# EAGLE design Adafruit DVI Sock for Pico (EAGLE 9.6.2)
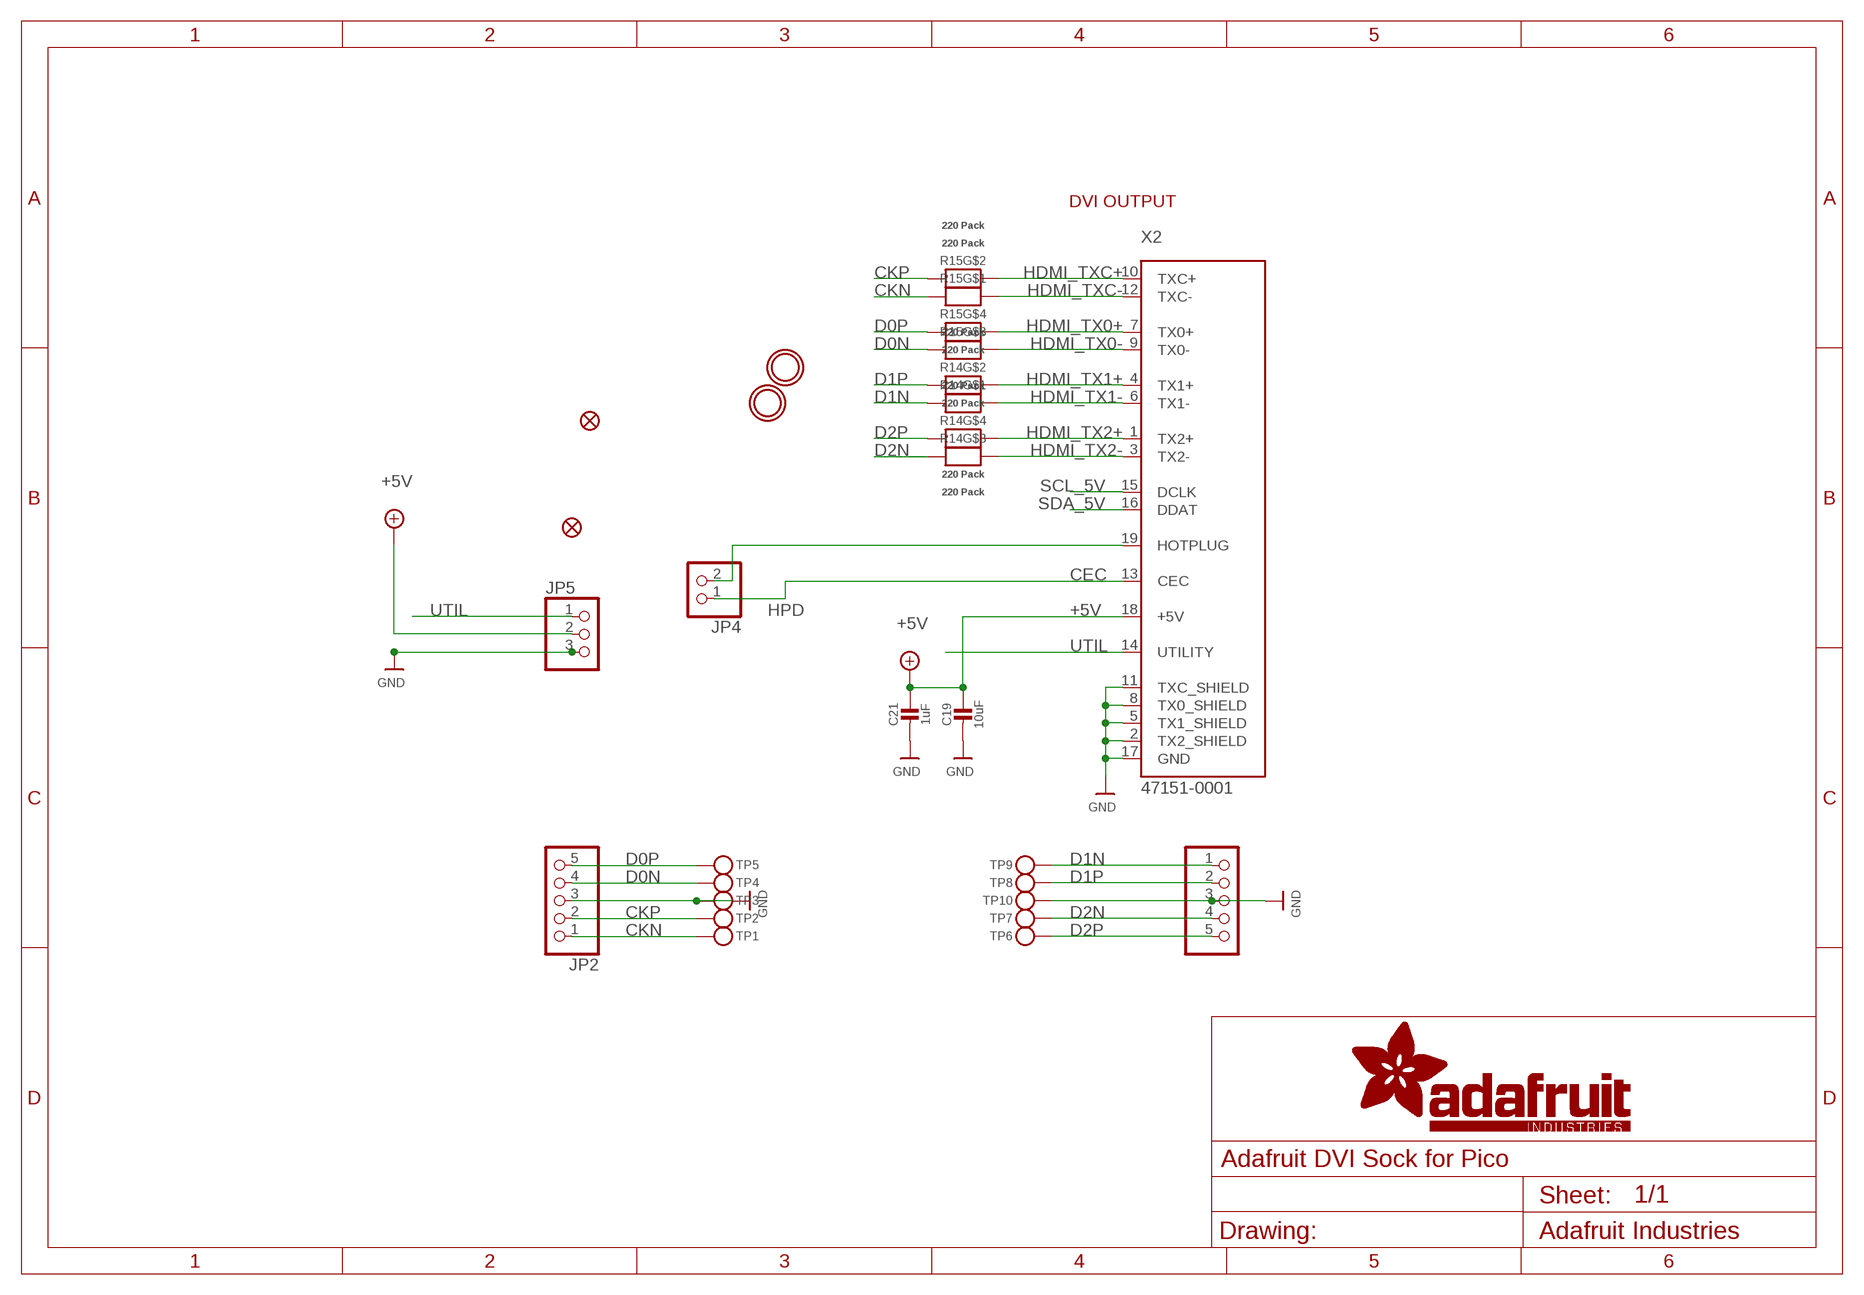
[diagram p0: schematic, sheet 1]

## Parts
C19  10uF  CAP_CERAMIC0805-NOOUTLINE  [0805-NO]
C21  1uF  CAP_CERAMIC0603_NO  [0603-NO]
FID1  FIDUCIAL_1MM  [FIDUCIAL_1MM]
FID2  FIDUCIAL_1MM  [FIDUCIAL_1MM]
JP2  HEADER-1X5  [1X05_OVAL]
JP3  HEADER-1X5  [1X05_OVAL]
JP4  HEADER-1X2ROUND  [1X02_ROUND]
JP5  HEADER-1X3ROUND  [1X03_ROUND]
R14  220 Pack  RESISTOR_4PACK  [RESPACK_4X0603]
R15  220 Pack  RESISTOR_4PACK  [RESPACK_4X0603]
TP1  TESTPOINT_1X3  [TESTPOINT_RECT_1X3MM]
TP2  TESTPOINT_1X3  [TESTPOINT_RECT_1X3MM]
TP3  TESTPOINT_1X3  [TESTPOINT_RECT_1X3MM]
TP4  TESTPOINT_1X3  [TESTPOINT_RECT_1X3MM]
TP5  TESTPOINT_1X3  [TESTPOINT_RECT_1X3MM]
TP6  TESTPOINT_1X3  [TESTPOINT_RECT_1X3MM]
TP7  TESTPOINT_1X3  [TESTPOINT_RECT_1X3MM]
TP8  TESTPOINT_1X3  [TESTPOINT_RECT_1X3MM]
TP9  TESTPOINT_1X3  [TESTPOINT_RECT_1X3MM]
TP10  TESTPOINT_1X3  [TESTPOINT_RECT_1X3MM]
U$5  MOUNTINGHOLE2.5  [MOUNTINGHOLE_2.5_PLATED]
U$6  MOUNTINGHOLE2.5  [MOUNTINGHOLE_2.5_PLATED]
X2  47151-0001  HDMI_MOLEX_47151  [HDMI_MOLEX_47151-0001]

## Nets
+5V: C19.1 C21.1 JP5.2 X2.18(+5V)
CEC: JP4.1 X2.13(CEC)
CKN: JP2.1 R15.8 TP1.P$1
CKP: JP2.2 R15.7 TP2.P$1
D0N: JP2.4 R15.6 TP4.P$1
D0P: JP2.5 R15.5 TP5.P$1
D1N: JP3.1 R14.8 TP9.P$1
D1P: JP3.2 R14.7 TP8.P$1
D2N: JP3.4 R14.6 TP7.P$1
D2P: JP3.5 R14.5 TP6.P$1
GND: C19.2 C21.2 JP2.3 JP3.3 JP5.3 TP3.P$1 TP10.P$1 X2.2(TX2_SHIELD) X2.5(TX1_SHIELD) X2.8(TX0_SHIELD) X2.11(TXC_SHIELD) X2.17(GND)
HDMI_TX0+: R15.4 X2.7(TX0+)
HDMI_TX0-: R15.3 X2.9(TX0-)
HDMI_TX1+: R14.2 X2.4(TX1+)
HDMI_TX1-: R14.1 X2.6(TX1-)
HDMI_TX2+: R14.4 X2.1(TX2+)
HDMI_TX2-: R14.3 X2.3(TX2-)
HDMI_TXC+: R15.2 X2.10(TXC+)
HDMI_TXC-: R15.1 X2.12(TXC-)
HPD: JP4.2 X2.19(HOTPLUG)
SCL_5V: X2.15(DCLK)
SDA_5V: X2.16(DDAT)
UTIL: JP5.1 X2.14(UTILITY)

## Notes on the sheet
- DVI OUTPUT

## Power pins joined to a net without a drawn wire
GND: X2.P$1(GND) X2.P$2(GND) X2.P$3(GND) X2.P$4(GND)

## Library data of the parts
C19 = microbuilder:CAP_CERAMIC: Ceramic Capacitors For new designs, use the packages preceded by an '_' character since they are more reliable: The following footprints should be used on most boards: _0402 - Standard footprint for regular board layouts _0603 - Standard footprint for regular board layouts _0805 - Standard footprint for regular board layouts _1206 - Standard footprint for regular board layouts For extremely tight-pitch boards where space is at a premium, the following 'micro-pitch' footprints can be used (smaller pads, no silkscreen outline, etc.): _0402MP - Micro-pitch footprint for very dense/compact boards _0603MP - Micro-pitch footprint for very dense/compact boards _0805MP - Micro-pitch footprint for very dense/compact boards _1206MP - Micro-pitch footprint for very dense/compact boards; REV: A
C21 = microbuilder:CAP_CERAMIC: Ceramic Capacitors For new designs, use the packages preceded by an '_' character since they are more reliable: The following footprints should be used on most boards: _0402 - Standard footprint for regular board layouts _0603 - Standard footprint for regular board layouts _0805 - Standard footprint for regular board layouts _1206 - Standard footprint for regular board layouts For extremely tight-pitch boards where space is at a premium, the following 'micro-pitch' footprints can be used (smaller pads, no silkscreen outline, etc.): _0402MP - Micro-pitch footprint for very dense/compact boards _0603MP - Micro-pitch footprint for very dense/compact boards _0805MP - Micro-pitch footprint for very dense/compact boards _1206MP - Micro-pitch footprint for very dense/compact boards
FID1 FID2 = microbuilder:FIDUCIAL: Fiducial Alignment Points Various fiducial points for machine vision alignment.; BOM: EXCLUDE
JP2 JP3 = microbuilder:HEADER-1X5: PIN HEADER
JP4 = microbuilder:HEADER-1X2: PIN HEADER
JP5 = microbuilder:HEADER-1X3: PIN HEADER
R14 R15 = microbuilder:RESISTOR_4PACK: Resistor Packs (4 resistors) 4 x 0603 10K 1/16W - Digikey: YC164J-10KCT-ND
TP1-TP10 = microbuilder:TESTPOINT: Test Point Various test points for characterisation and PCB testing TESTPOINT_SMT - Compact Surface Mount Test Point [Digikey: 5016KTR-ND]
U$5 U$6 = adafruit_electromech:MOUNTINGHOLE: Mounting Hole For #2 screws (0.086"/2.18mm width, 0.094"/2.4mm hole) use 2.5mm; BOM: EXCLUDE
X2 = adafruit_electromech:HDMI_MOLEX_47151: The default footprint uses layer 46 (Milling) for the tabs, the DIMLAYER footprint uses layer 20 (Dimensions). Both will probably require special instructions to the board house; LCSC: C138388

## Net classes
1 highpower: width 0.305 mm, drill 0.381 mm

## Board
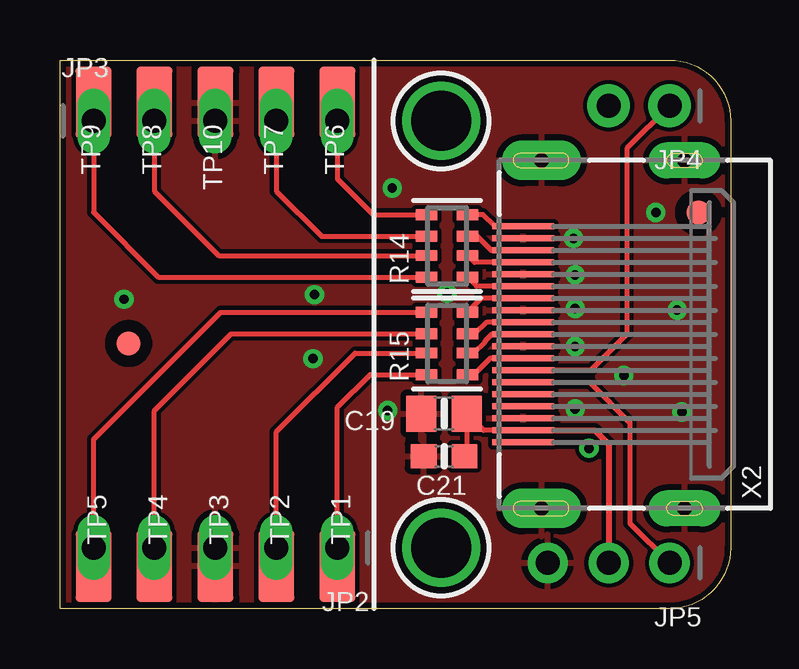
[diagram p1: board, top side]
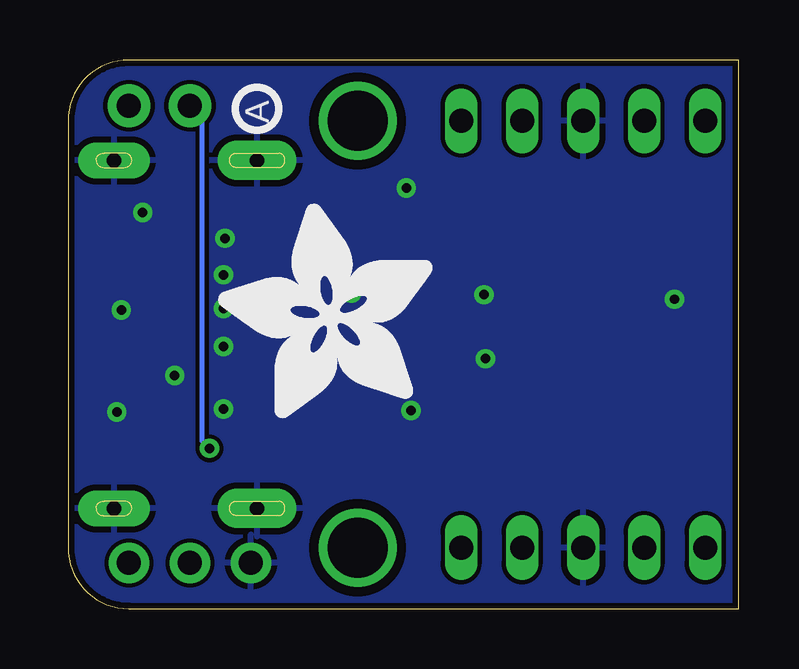
[diagram p2: board, bottom side, seen from below]

Size 27.94 x 22.86 mm. Coordinates in mm from the lower left corner, seen from the top.
Outline: 0,0 0,22.86 25.4,22.86 arc-90 27.94,20.32 27.94,2.54 arc-90 25.4,0 0,0
Copper layers (1*16): Top 0.035mm / dielectric 1.5mm / Bottom 0.035mm
Design rules "adafruit 7-7": minimum track width 7mil, minimum drill 15.5mil, track to track 7mil, track to pad 7mil, pad to pad 7mil, via to via 7mil, smd to smd 7mil, copper to edge 10mil, drill to drill 8mil, minimum pad ring 7mil, minimum via ring 8mil, stop-mask expansion 2mil, vias tented up to drill 20mil, thermal gap 10mil

### Footprints (pad centres in the part's own frame; a part is rotated, then mirrored left to right if it is on the bottom)
0805-NO = smd 1.24 x 1.5: 1 -0.95,0; 2 0.95,0
0603-NO = smd 1.075 x 1: 1 -0.85,0; 2 0.85,0
FIDUCIAL_1MM = smd 1 x 1: 1 0,0
1X05_OVAL = drill 1 long: 1 -5.08,0; 2 -2.54,0; 3 0,0; 4 2.54,0; 5 5.08,0
1X02_ROUND = drill 1 pad 1.778: 1 -1.27,0; 2 1.27,0
1X03_ROUND = drill 1 pad 1.676: 1 -2.54,0; 2 0,0; 3 2.54,0
RESPACK_4X0603 = smd 0.45 x 0.9: 1 -1.3,-0.85; 2 -0.4,-0.85; 3 0.4,-0.85; 4 1.3,-0.85; 5 1.3,0.85; 6 0.4,0.85; 7 -0.4,0.85; 8 -1.3,0.85
TESTPOINT_RECT_1X3MM = smd 3 x 1.5: P$1 0,0
MOUNTINGHOLE_2.5_PLATED = drill 2.5 pad 3.2: P$1 0,0
HDMI_MOLEX_47151-0001 = smd 0.25 x 2.6: 1 4.5,3.302; 2 4,3.302; 3 3.5,3.302; 4 3,3.302; 5 2.5,3.302; 6 2,3.302; 7 1.5,3.302; 8 1,3.302; 9 0.5,3.302; 10 0,3.302; 11 -0.5,3.302; 12 -1,3.302; 13 -1.5,3.302; 14 -2,3.302; 15 -2.5,3.302; 16 -3,3.302; 17 -3.5,3.302; 18 -4,3.302; 19 -4.5,3.302 | drill 0.6 pad 1.65 long: P$1 -7.25,2.542; P$2 7.25,2.542 | drill 0.6 pad 1.5 long: P$3 7.25,-3.418; P$4 -7.25,-3.418

### Placement (x,y rotation side)
C19  16,8.13 180 top
C21  16,6.35 180 top
E$1  [PCBFEAT-REV-040]  20.07,20.83 270 bottom
FID1  26.61,16.51 0 top
FID2  2.86,11.05 0 top
JP2  6.48,2.54 180 top
JP3  6.48,20.32 0 top
JP4  24.13,20.95 180 top
JP5  22.86,1.91 180 top
PLABEL0  [PLABEL0]  23.37,0.25 90 top
PLABEL1  [PLABEL1]  27.43,1.14 90 top
PLABEL2  [PLABEL2]  19.18,0.25 90 top
PLABEL3  [PLABEL3]  27.56,19.56 90 top
PLABEL4  [PLABEL4]  21.59,19.81 90 top
PLABEL5  [PLABEL5]  7.49,5.46 90 top
PLABEL6  [PLABEL6]  11.56,4.19 90 top
PLABEL7  [PLABEL7]  9.02,4.19 90 top
PLABEL9  [PLABEL9]  3.94,4.19 90 top
PLABEL10  [PLABEL10]  1.4,4.19 90 top
PLABEL11  [PLABEL11]  11.56,12.06 90 top
PLABEL12  [PLABEL12]  9.02,12.83 90 top
PLABEL14  [PLABEL14]  3.94,12.06 90 top
PLABEL15  [PLABEL15]  1.4,12.83 90 top
PLABEL16  [PLABEL16]  24.64,11.75 90 bottom
PLABEL17  [PLABEL17]  11.56,4.13 90 bottom
PLABEL18  [PLABEL18]  9.02,4.13 90 bottom
PLABEL19  [PLABEL19]  6.48,4.25 90 bottom
PLABEL20  [PLABEL20]  3.94,4.13 90 bottom
PLABEL21  [PLABEL21]  1.4,4.13 90 bottom
PLABEL22  [PLABEL22]  11.56,12.26 90 bottom
PLABEL23  [PLABEL23]  9.02,13.02 90 bottom
PLABEL24  [PLABEL24]  6.48,14.67 90 bottom
PLABEL25  [PLABEL25]  3.94,12.26 90 bottom
PLABEL26  [PLABEL26]  1.4,12.76 90 bottom
R14  16.13,15.11 90 top
R15  16.13,11.05 90 top
TP1  11.56,1.78 90 top
TP2  9.02,1.78 90 top
TP3  6.48,1.78 90 top
TP4  3.94,1.78 90 top
TP5  1.4,1.78 90 top
TP6  11.56,21.08 270 top
TP7  9.02,21.08 270 top
TP8  3.94,21.08 270 top
TP9  1.4,21.08 270 top
TP10  6.48,21.08 270 top
U$5  15.88,2.54 0 top
U$6  15.88,20.32 0 top
U$7  [ADAFRUIT_9MM]  12.76,7.94 90 bottom
X2  22.61,11.43 90 top

### Tracks (layer width: path | path; a pad name or v marks a point on that pad's centre or on a via)
+5V
  Top 0.203: X2.18 17.65,7.43 C19.1 16.95,6.45 C21.1
  Top 0.254: X2.18 22.29,7.43 22.86,6.86 JP5.2
CEC
  Top 0.203: JP4.1 23.62,19.18 23.62,11.43 22.12,9.93 X2.13
CKN
  Top 0.203: JP2.1 11.56,8.38 12.92,9.75 R15.8
  Top 0.406: TP1.P$1 JP2.1
CKP
  Top 0.203: JP2.2 9.02,2.67 9.02,7.37 12.3,10.65 R15.7
  Top 0.406: TP2.P$1 9.02,2.67
D0N
  Top 0.203: JP2.4 3.94,8.26 7.13,11.45 R15.6
  Top 0.406: TP4.P$1 JP2.4
D0P
  Top 0.203: JP2.5 1.4,7.05 6.7,12.35 R15.5
  Top 0.406: TP5.P$1 JP2.5
D1N
  Top 0.203: JP3.1 1.4,16.51 4.09,13.81 R14.8
  Top 0.406: TP9.P$1 JP3.1
D1P
  Top 0.203: JP3.2 3.94,17.4 6.62,14.71 R14.7
  Top 0.406: TP8.P$1 JP3.2
D2N
  Top 0.203: JP3.4 9.02,17.4 10.9,15.51 R14.6
  Top 0.406: TP7.P$1 JP3.4
D2P
  Top 0.203: JP3.5 11.56,17.91 13.05,16.41 R14.5
  Top 0.406: TP6.P$1 JP3.5
GND  (via drill 0.39)
  Top 0.406: TP10.P$1 JP3.3 | TP3.P$1 JP2.3
  other vias: 10.6,13.08 10.54,10.41 2.67,12.89 13.84,17.53 23.5,9.72 21.46,8.32 21.46,10.92 21.46,12.51 21.46,13.91 21.4,15.43 16.13,13.14 13.65,8.26 24.83,16.51 25.91,8.19 25.72,12.45
  pour Top: 0,22.86 27.94,22.86 27.94,0 0,0
  pour Bottom: 0,22.86 27.94,22.86 27.94,0 0,0
HDMI_TX0+
  Top 0.203: X2.7 17.56,12.93 R15.4
HDMI_TX0-
  Top 0.203: X2.9 17.77,11.93 17.29,11.45 R15.3
HDMI_TX1+
  Top 0.203: X2.4 17.26,14.43 R14.2
HDMI_TX1-
  Top 0.203: X2.6 17.36,13.43 R14.1
HDMI_TX2+
  Top 0.203: X2.1 18.11,15.93 17.62,16.41 R14.4
HDMI_TX2-
  Top 0.203: X2.3 17.96,14.93 17.38,15.51 R14.3
HDMI_TXC+
  Top 0.203: X2.10 17.98,11.43 17.71,11.15 17.71,11.11 17.25,10.65 R15.2
HDMI_TXC-
  Top 0.203: X2.12 17.92,10.43 17.24,9.75 R15.1
HPD  (via drill 0.39)
  Top 0.203: X2.19 21.79,6.93 v22.04,6.68
  Bottom 0.203: v22.04,6.68 22.35,6.98 22.35,20.45 JP4.2
UTIL
  Top 0.203: X2.14 22.07,9.43 23.75,7.75 23.75,3.56 JP5.1

### Text on the board
Pinguin_tBackup: HPD | CEC | 20 | D1-/19 | D1+/18 | 18 | G | 17 | D2-/17 | 16 | D2+/16 | DVI SOCK | 12/D0+ | 13/D0- | G | 14 | 14/CK+ | 15 | 15/CK- | Util | GND | 5
Pinguin_bBackup: D1-/19 | D1+/18 | GND | D2-/17 | D2+/16 | DVI Sock / For RP2 Pico | 12/D0+ | 13/D0- | GND | 14/CK+ | 15/CK-